# Altium project PROJ_B555.PrjPcb
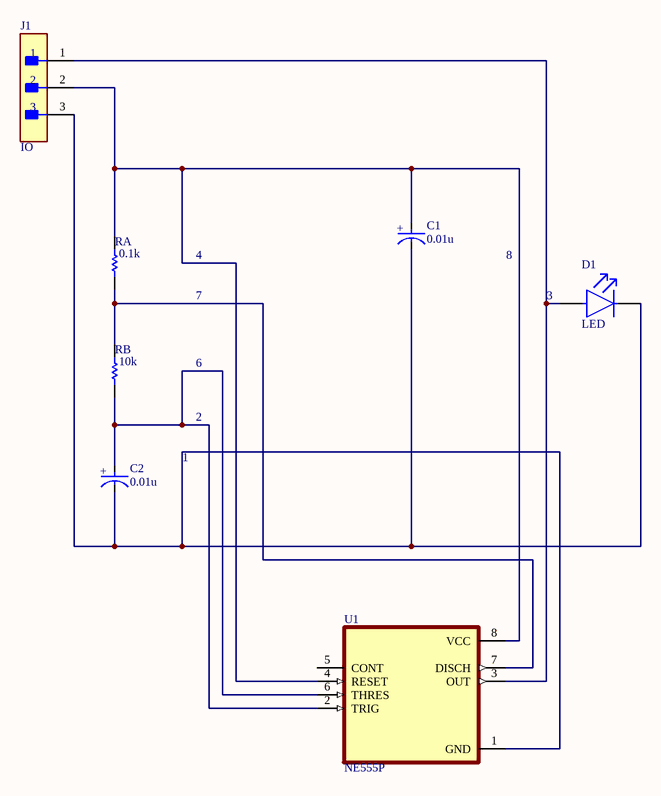
[diagram p0: SCHE_B555.SchDoc]
1 sheet, 7 parts. Net scope: global (net labels, ports and power ports of the same name join across sheets).
Board file: PCBB_B555.PcbDoc

## Sheet SCHE_B555.SchDoc
size A; DocumentNumber: 1; SheetNumber: 1; SheetTotal: 1

### Parts
C1  0.01u  [FP-RAD-TH-D_16_0_5-L_31_5-MFG]
C2  0.01u  [FP-RAD-TH-D_16_0_5-L_31_5-MFG]
D1  LED  [FP-HLMP-1301-MFG]
J1  IO  [FP-22-28-4030-MFG]
RA  0.1k  [RESA60-630X240]
RB  10k  [RESA60-630X240]
U1  NE555P  [DIP794W45P254L959H508Q8]

### Nets
NetC1_1: C1.1(C) C2.1(C) D1.1(C) J1.3 U1.1(GND)
NetC1_2: C1.2(A) J1.2 RA.1 U1.4(RESET) U1.8(VCC)
NetC2_2: C2.2(A) RB.2 U1.2(TRIG) U1.6(THRES)
NetD1_2: D1.2(A) J1.1 U1.3(OUT)
NetRA_2: RA.2 RB.1 U1.7(DISCH)

Not connected (* = marked no-connect by the designer): U1 5(CONT)

### Notes on the sheet
- 4
- 7
- 8
- (near D1) 3
- 6
- 2
- 1
- (in symbol CMP-05427-001651-1) +

### Library data of the parts
C1 C2 = CMP-05427-001651-1: Leakage Current: 3uA; Ripple Current (AC): 1.47A; Capacitance: 2.2mF; Tolerance: 20%; Voltage Rating: 50V; Lead Diameter: 0.8mm; Lead/Base Style: Straight; Dissipation Factor: 0.14%; Life (Hours): 2000Hour; Mount: Through Hole; RoHS Compliant: Yes; Lead Pitch: 7.5mm; Package Quantity: 100; REACH SVHC: No SVHC; Height: 31.5mm; Case/Package: Radial; Contact Plating: Tin; Radiation Hardening: No; Termination: Radial; Construction: RADIAL; Diameter: 16mm; Series: NHG; Max Operating Temperature: 105°C; Length: 31.5mm; Height - Seated (Max): 1.319inch; Width: 16mm; Voltage Rating (DC): 50V; Min Operating Temperature: -55°C; Voltage: 50V; Packaging: Bulk; Number of Pins: 2; Ripple Current: 1.47A
D1 = CMP-18399-000007-1: Manufacturer: Broadcom; Forward Current: 10mA; Max Junction Temp: +110°C; Wavelength: 626nm; Colour: Red; Led Orientation: Straight; Viewing Angle: 60°; Luminous Intensity: 3.4mcd; Forward Voltage: 1.9V; Reverse Voltage: 5V; Peak Emmision Wavelength: 635nm; Mouser Description: Standard LEDs - Through Hole Red Diffused 635nm 3.4mcd; RoHS: TRUE; ComponentLink2Description: Datasheet; Device Class L1: Optoelectronics; Temperature Range High: +100°C; Manufacturer Part Number: HLMP-1301; ComponentLink2URL: https://docs.broadcom.com/docs/AV02-1555EN; Digikey Description: LED RED DIFFUSED T-1 T/H; Automotive: No; Device Class L2: LEDs; Temperature Range Low: -40°C; Octopart: https://octopart.com/hlmp-1301-broadcom-71130345; Category: Diode; Lead Free: Yes; Device Class L3: unset; Package: 0; Temperature: -40°C to +100°C
J1 = CMP-04776-000098-1: {1 to OUT, 2 to V_CC, 3 to GNC}; Manufacturer: Molex; Conn Orientation: Vertical; Conn Gender: Male; Current Rating: 4A; Pitch: 2.54mm; Voltage Rating: 500V; Number Of Contacts: 3; Category: Conn; Number Of Rows: 1; Manufacturer Part Number: 22-28-4030; RoHS: TRUE; Package: 22-28-4030; Footprint Url: https://www.molex.com/pdm_docs/sd/022284030_sd.pdf; ComponentLink2Description: Datasheet; Device Class L2: Headers and Wire Housings; Automotive: No; Temperature Range Low: -40°C; Digikey Description: CONN HEADER VERT 3POS 2.54MM; Mouser Description: Headers & Wire Housings 3P VERT HEADER Sn; Contact Material: Gold,Nickel; Device Class L1: Connectors; Lead Free: Yes; Device Class L3: unset; Temperature Range High: +80°C; Octopart: https://octopart.com/0022284030-molex-10476094; ComponentLink2URL: https://www.molex.com/webdocs/datasheets/pdf/en-us/0022284030_PCB_HEADERS.pdf; Height: 8.88mm; Temperature: -40°C to +80°C
RA RB = CMP-1659-00063-1: Tolerance: 20%; Shielding: Shielded; Current Rating: 1.3 A; Case\Package: 1008; ComponentLink1Description: Manufacturer URL; Packaging: Tape and Reel; ComponentLink2Description: Datasheet; Radiation Hardening: No; ComponentLink2URL: http://www.yageo.com/documents/recent/Yageo%20LR_MFR_2013.pdf; Min Operating Temperature: -55 degC; Mount: Surface Mount; Width: 2 mm; Length: 2.5 mm; Max Operating Temperature: 125 degC; PackageReference: MFR-25; Height: 1.2 mm; ComponentLink1URL: http://www.yageo.com/; DatasheetVersion: Apr-13; RoHSCompliant: true; Package Quantity: 3000; Case Code (Metric): 2520; PackageDescription: 2-Pin Axial Lead, Dia 2.4 mm, Body Length 6.3 mm
U1 = NE555P: Price: None; Package: None; Availability: Unavailable; MP: NE555P; Value: *